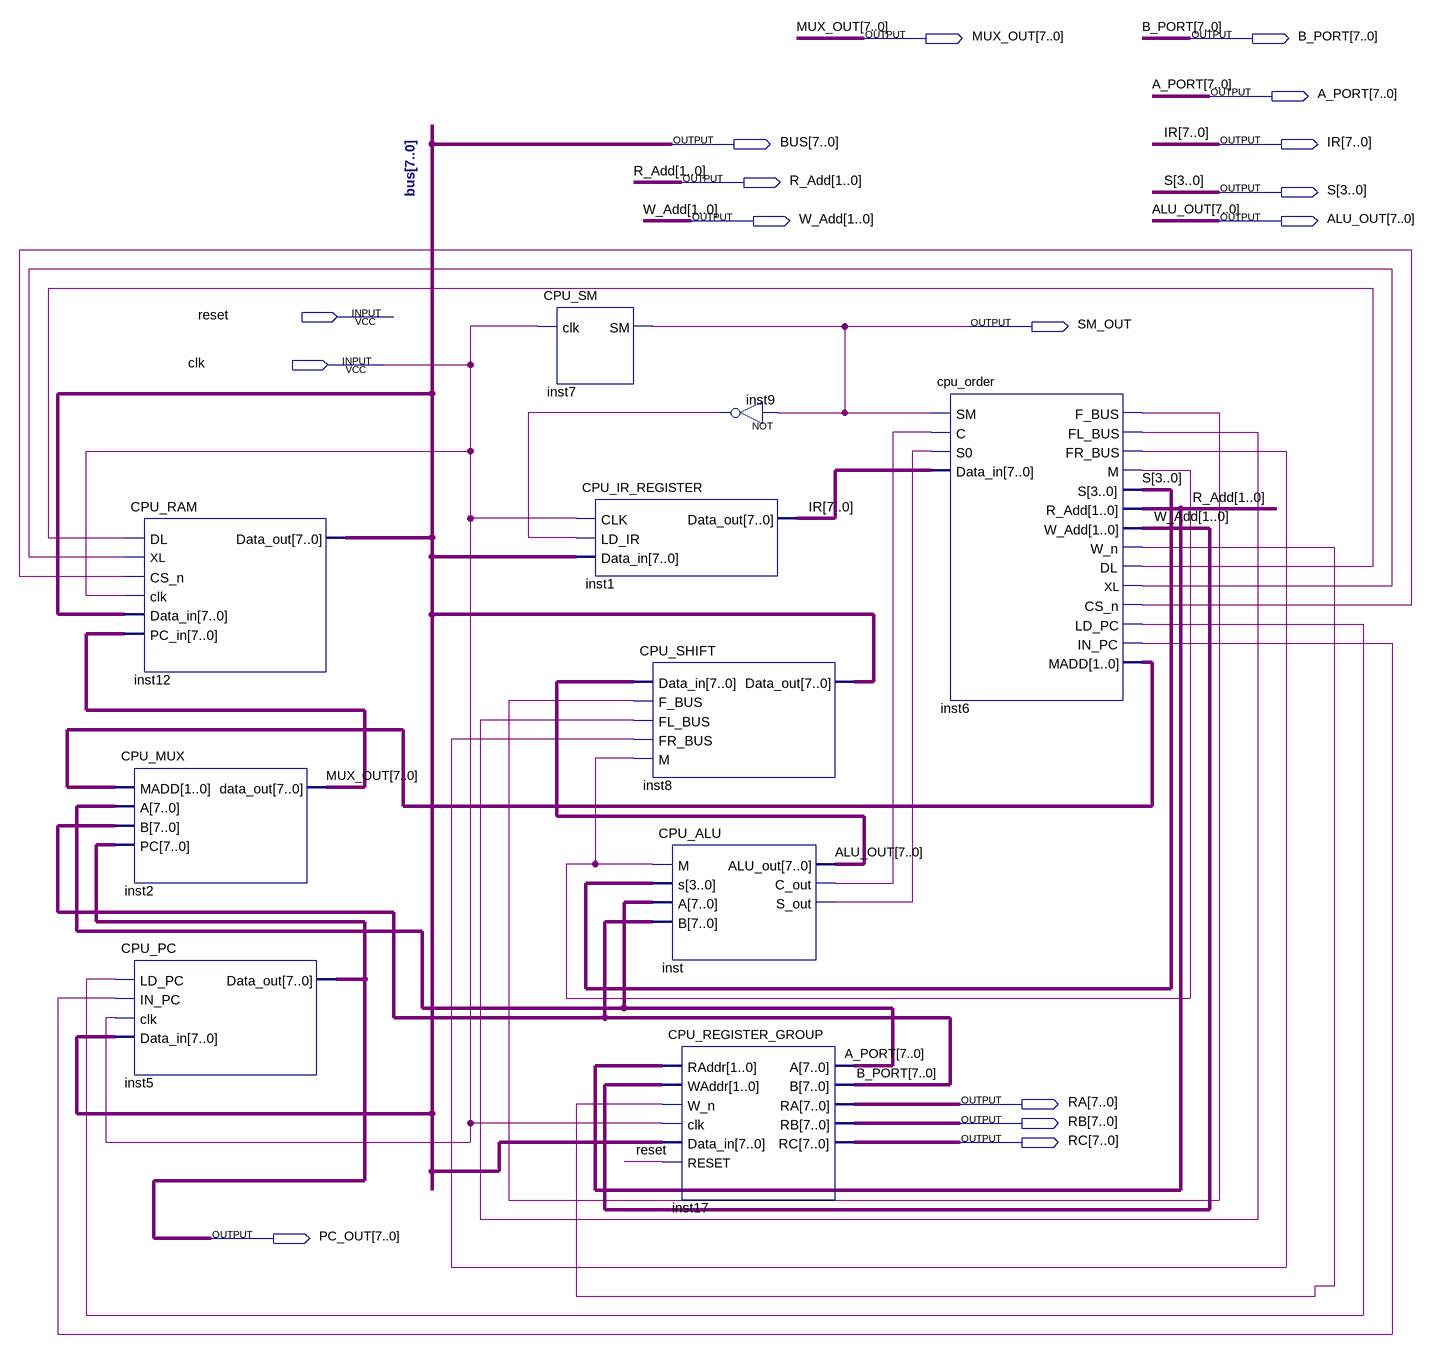
[diagram p0: schematic sheet]
// Quartus schematic CPU.bdf as structural Verilog: 10 symbols, 16 pins
module CPU (
  input  reset,
  input  clk,
  output [7:0] MUX_OUT,
  output [7:0] B_PORT,
  output [7:0] A_PORT,
  output [7:0] BUS,
  output [7:0] IR,
  output [1:0] R_Add,
  output [3:0] S,
  output [1:0] W_Add,
  output [7:0] ALU_OUT,
  output SM_OUT,
  output [7:0] RA,
  output [7:0] RB,
  output [7:0] RC,
  output [7:0] PC_OUT
);

  wire inst6_cs_n, inst6_dl, inst6_f_bus, inst6_fl_bus, inst6_fr_bus, inst6_in_pc, inst6_ld_pc, inst6_m,
       inst6_w_n, inst6_xl, inst9_out, inst_c_out, inst_s_out;
  wire [1:0] inst6_madd;

  CPU_RAM inst12 (
    .DL(inst6_dl), .XL(inst6_xl), .CS_n(inst6_cs_n), .clk(clk), .Data_in(BUS), .PC_in(MUX_OUT), .Data_out(BUS));
  CPU_MUX inst2 (.MADD(inst6_madd), .A(A_PORT), .B(B_PORT), .PC(PC_OUT), .data_out(MUX_OUT));
  CPU_PC inst5 (.LD_PC(inst6_ld_pc), .IN_PC(inst6_in_pc), .clk(clk), .Data_in(BUS), .Data_out(PC_OUT));
  CPU_SM inst7 (.clk(clk), .SM(SM_OUT));
  CPU_IR_REGISTER inst1 (.CLK(clk), .LD_IR(inst9_out), .Data_in(BUS), .Data_out(IR));
  CPU_SHIFT inst8 (
    .Data_in(ALU_OUT), .F_BUS(inst6_f_bus), .FL_BUS(inst6_fl_bus), .FR_BUS(inst6_fr_bus), .M(inst6_m),
    .Data_out(BUS));
  CPU_ALU inst (.M(inst6_m), .s(S), .A(A_PORT), .B(B_PORT), .ALU_out(ALU_OUT), .C_out(inst_c_out), .S_out(inst_s_out));
  CPU_REGISTER_GROUP inst17 (
    .RAddr(R_Add), .WAddr(W_Add), .W_n(inst6_w_n), .clk(clk), .Data_in(BUS), .RESET(reset), .A(A_PORT),
    .B(B_PORT), .RA(RA), .RB(RB), .RC(RC));
  not inst9 (inst9_out, SM_OUT);
  cpu_order inst6 (
    .SM(SM_OUT), .C(inst_c_out), .S0(inst_s_out), .Data_in(IR), .F_BUS(inst6_f_bus), .FL_BUS(inst6_fl_bus),
    .FR_BUS(inst6_fr_bus), .M(inst6_m), .S(S), .R_Add(R_Add), .W_Add(W_Add), .W_n(inst6_w_n), .DL(inst6_dl),
    .XL(inst6_xl), .CS_n(inst6_cs_n), .LD_PC(inst6_ld_pc), .IN_PC(inst6_in_pc), .MADD(inst6_madd));
endmodule
